# EAGLE design pebble_qi_eagle (EAGLE 7.3.0)
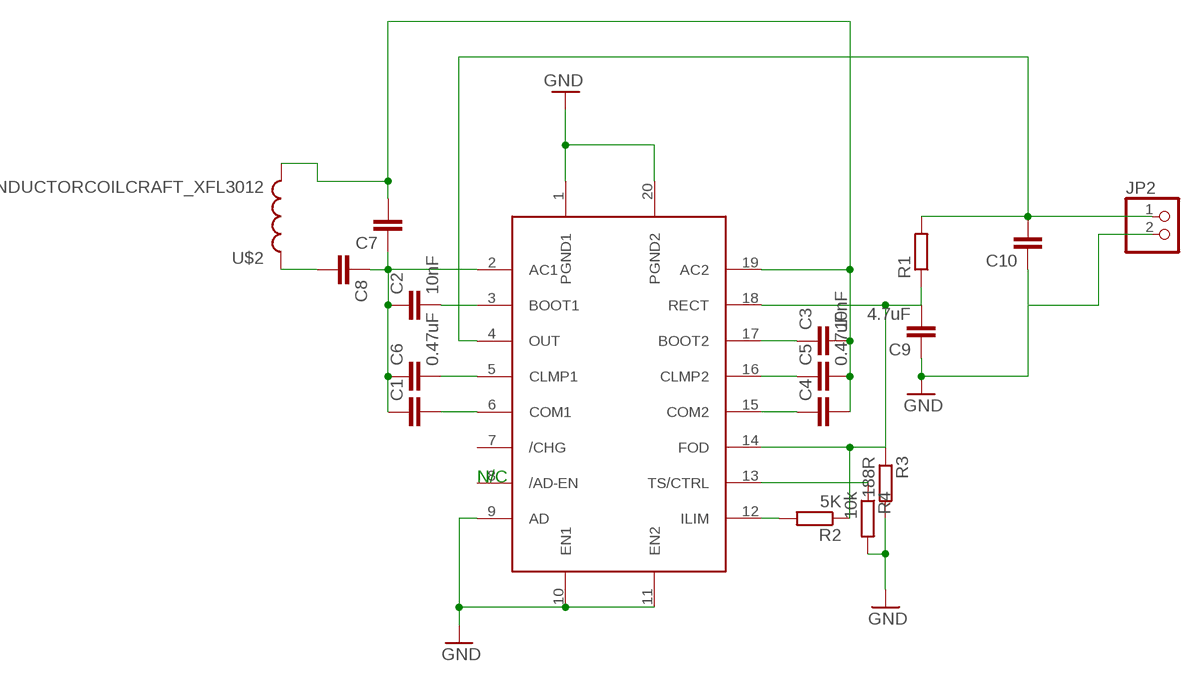
[diagram p0: schematic, sheet 1]

## Parts
C1  C-EUC0603  [C0603]
C2  10nF  C-EUC0603  [C0603]
C3  10nF  C-EUC0603  [C0603]
C4  C-EUC0603  [C0603]
C5  0.47uF  C-EUC0603  [C0603]
C6  0.47uF  C-EUC0603  [C0603]
C7  C-EUC0603  [C0603]
C8  C-EUC0603  [C0603]
C9  4.7uF  C-EUC0603  [C0603]
C10  C-EUC0603  [C0603]
JP2  PINHD-1X2/90  [1X02/90]
R1  R-EU_R0603  [R0603]
R2  5K  R-EU_R0603  [R0603]
R3  188R  R-EU_R0603  [R0603]
R4  10k  R-EU_R0603  [R0603]
U$1  BQ51013B  [QFNRHL20]
U$2  INDUCTORCOILCRAFT_XFL3012  [COILCRAFT_XFL3012]

## Nets
GND: C9.1 C10.1 JP2.2 R3.2 R4.2 U$1.1(PGND1) U$1.9(AD) U$1.10(EN1) U$1.11(EN2) U$1.20(PGND2)
N$1: C3.2 C4.2 C5.2 C7.2 U$1.19(AC2) U$2.P$2
N$2: C1.1 C2.1 C6.1 C7.1 C8.1 U$1.2(AC1)
N$3: C2.2 U$1.3(BOOT1)
N$4: C6.2 U$1.5(CLMP1)
N$5: C1.2 U$1.6(COM1)
N$6: R4.1 U$1.13(TS/CTRL)
N$7: C8.2 U$2.P$1
N$9: C4.1 U$1.15(COM2)
N$10: C5.1 U$1.16(CLMP2)
N$11: C3.1 U$1.17(BOOT2)
N$12: C9.2 R1.1 R2.1 R3.1 U$1.14(FOD) U$1.18(RECT)
N$13: C10.2 JP2.1 R1.2 U$1.4(OUT)
N$16: R2.2 U$1.12(ILIM)
Unconnected: U$1.7(/CHG) U$1.8(/AD-EN)

## Notes on the sheet
- N/C

## Library data of the parts
C1 C3-C10 = rcl:C-EU: CAPACITOR, European symbol
C2 = resistor:C-EU: CAPACITOR, European symbol
JP2 = pinhead:PINHD-1X2: PIN HEADER
R1-R4 = resistor:R-EU_: RESISTOR, European symbol
U$1 = ben_oxley:BQ51013B
U$2 = Ava:INDUCTOR

## Board
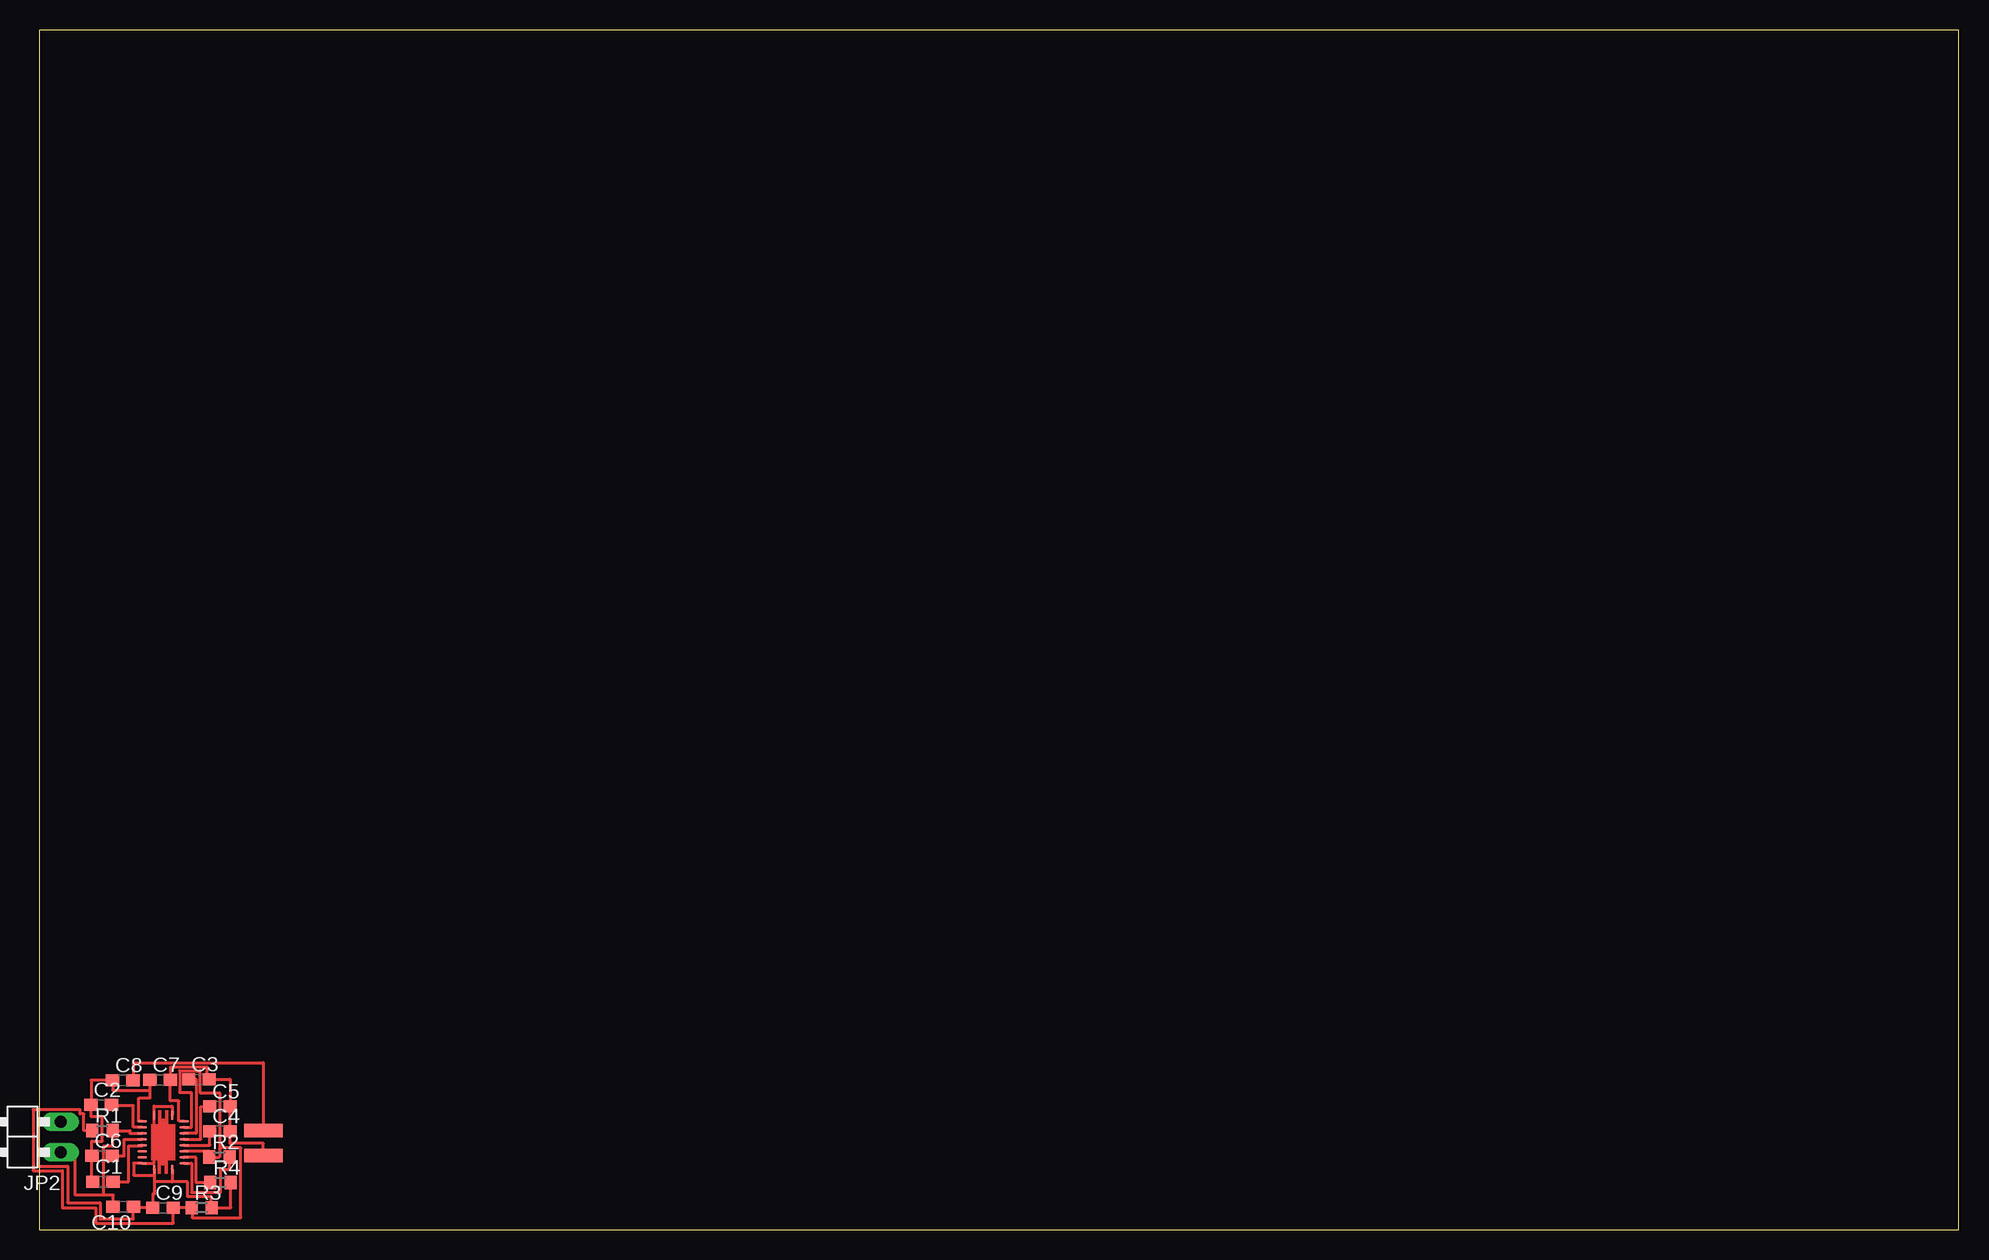
[diagram p1: board, top side]

Size 160 x 100 mm. Coordinates in mm from the lower left corner, seen from the top.
Outline: 0,0 160,0 160,100 0,100 0,0
Copper layers (1*16): Top 0.035mm / dielectric 1.5mm / Bottom 0.035mm
Design rules "default": minimum track width 10mil, minimum drill 24mil, track to track 8mil, track to pad 8mil, pad to pad 8mil, via to via 8mil, smd to smd 8mil, copper to edge 40mil, drill to drill 8mil, minimum pad ring 10mil, minimum via ring 8mil, stop-mask expansion 4mil, vias tented up to drill 0mil, thermal gap 10mil

### Footprints (pad centres in the part's own frame; a part is rotated, then mirrored left to right if it is on the bottom)
C0603 = smd 1.1 x 1: 1 -0.85,0; 2 0.85,0
1X02/90 = drill 1.016 long: 1 -1.27,-3.81; 2 1.27,-3.81
R0603 = smd 1 x 1.1: 1 -0.85,0; 2 0.85,0
QFNRHL20 = smd 0.8 x 0.25: 1 -2.25,-0.75; 10 2.25,-0.75; 11 2.25,0.75; 20 -2.25,0.75 | smd 0.25 x 0.8: 2 -1.75,-1.75; 3 -1.25,-1.75; 4 -0.75,-1.75; 5 -0.25,-1.75; 6 0.25,-1.75; 7 0.75,-1.75; 8 1.25,-1.75; 9 1.75,-1.75; 12 1.75,1.75; 13 1.25,1.75; 14 0.75,1.75; 15 0.25,1.75; 16 -0.25,1.75; 17 -0.75,1.75; 18 -1.25,1.75; 19 -1.75,1.75
COILCRAFT_XFL3012 = smd 1.12 x 3.2: P$1 -1.04,0; P$2 1.04,0

### Placement (x,y rotation side)
C1  5.32,4 0 top
C2  5.18,10.39 0 top
C3  13.32,12.53 0 top
C4  15.09,8.2 0 top
C5  15.07,10.26 0 top
C6  5.26,6.14 0 top
C7  10.1,12.48 0 top
C8  6.98,12.45 0 top
C9  10.34,1.81 0 top
C10  7.02,1.88 180 top
JP2  -2.01,7.71 90 top
R1  5.28,8.24 0 top
R2  15.05,6.04 0 top
R3  13.56,1.81 0 top
R4  15.13,3.92 0 top
U$1  10.35,7.28 270 top
U$2  18.7,7.21 270 top

### Tracks (layer width: path | path; a pad name or v marks a point on that pad's centre or on a via)
GND
  Top 0.25: U$1.20 11.1,10.29 9.6,10.29 U$1.1 9.6,5.53 U$1.9 7.89,5.53 7.89,4.53 9.61,4.53 | U$1.10 9.61,5.03 9.61,4.53 | 9.61,4.53 9.61,3.98 | 9.61,3.98 9.61,2.96 9.49,2.96 C9.1 7.87,1.81 C10.1 7.87,0.89 5.1,0.89 5.1,2.24 2.38,2.24 2.38,5.28 -0.07,5.28 -0.07,8.98 JP2.2 | U$1.11 11.1,3.98 | 11.1,3.98 9.61,3.98 | R4.2 15.98,1.81 R3.2 14.34,1.81 14.34,2.75 12.38,2.75 12.38,3.98 11.1,3.98
N$1
  Top 0.25: U$1.19 11.66,9.03 11.66,10.71 10.95,10.71 C7.2 10.95,13.54 14.03,13.54 14.03,12.53 C3.2 15.93,12.53 C5.2 15.93,8.2 C4.2 15.94,7.17 18.69,7.19 18.69,6.18 U$2.P$2
N$2
  Top 0.25: U$1.2 8.32,9.03 8.32,10.97 9.25,10.97 9.25,11.62 | 9.25,11.62 C7.1 | C1.1 4.42,4 C6.1 4.4,6.14 4.4,7.38 5.28,7.38 5.28,9.4 4.33,9.4 C2.1 4.33,12.45 C8.1 6.14,11.62 9.25,11.62
N$3
  Top 0.25: U$1.3 7.86,8.53 7.86,10.32 6.04,10.32 C2.2
N$4
  Top 0.25: C6.2 7.1,6.14 7.1,7.51 8.6,7.51 U$1.5
N$5
  Top 0.25: C1.2 7.47,4 7.47,6.97 8.6,6.97 U$1.6
N$6
  Top 0.25: R4.1 13.09,3.92 13.09,6.01 12.1,6.01 U$1.13
N$7
  Top 0.25: C8.2 7.91,12.45 7.91,13.91 18.7,13.91 U$2.P$1
N$9
  Top 0.25: U$1.15 14.23,7.03 C4.1
N$10
  Top 0.25: U$1.16 13.49,7.53 13.49,10.25 C5.1
N$11
  Top 0.25: C3.1 13.09,12.53 13.09,8.01 12.1,8.01 U$1.17
N$12
  Top 0.25: U$1.14 14.19,6.53 14.19,6.04 R2.1 15.05,6.04 15.05,6.72 15.05,6.8 | U$1.18 12.72,8.53 12.72,11.41 11.71,11.41 11.71,13.25 13.41,13.25 13.41,11.4 15.05,11.4 15.05,6.8 | R1.1 3.74,8.24 3.74,9.64 3.42,9.64 3.42,9.99 -0.5,9.99 -0.5,4.9 1.95,4.9 1.95,1.81 4.74,1.81 4.74,0.53 11.19,0.53 C9.2 R3.1 12.76,1.81 12.76,1 16.81,1 16.81,6.8 15.05,6.8
N$13
  Top 0.25: U$1.4 8.6,8.01 7.56,8.01 7.56,8.24 R1.2 6.12,6.92 5.36,6.92 5.36,2.88 | JP2.1 3.04,6.44 3.04,2.88 5.36,2.88 | C10.2 6.2,1.88 6.2,2.88 5.36,2.88
N$16
  Top 0.25: U$1.12 12.72,5.53 12.72,3.09 15.12,3.09 15.12,5.03 15.9,5.03 R2.2